# Altium schematic sheet Schematic PoE.schdoc
size 419 x 303 mm
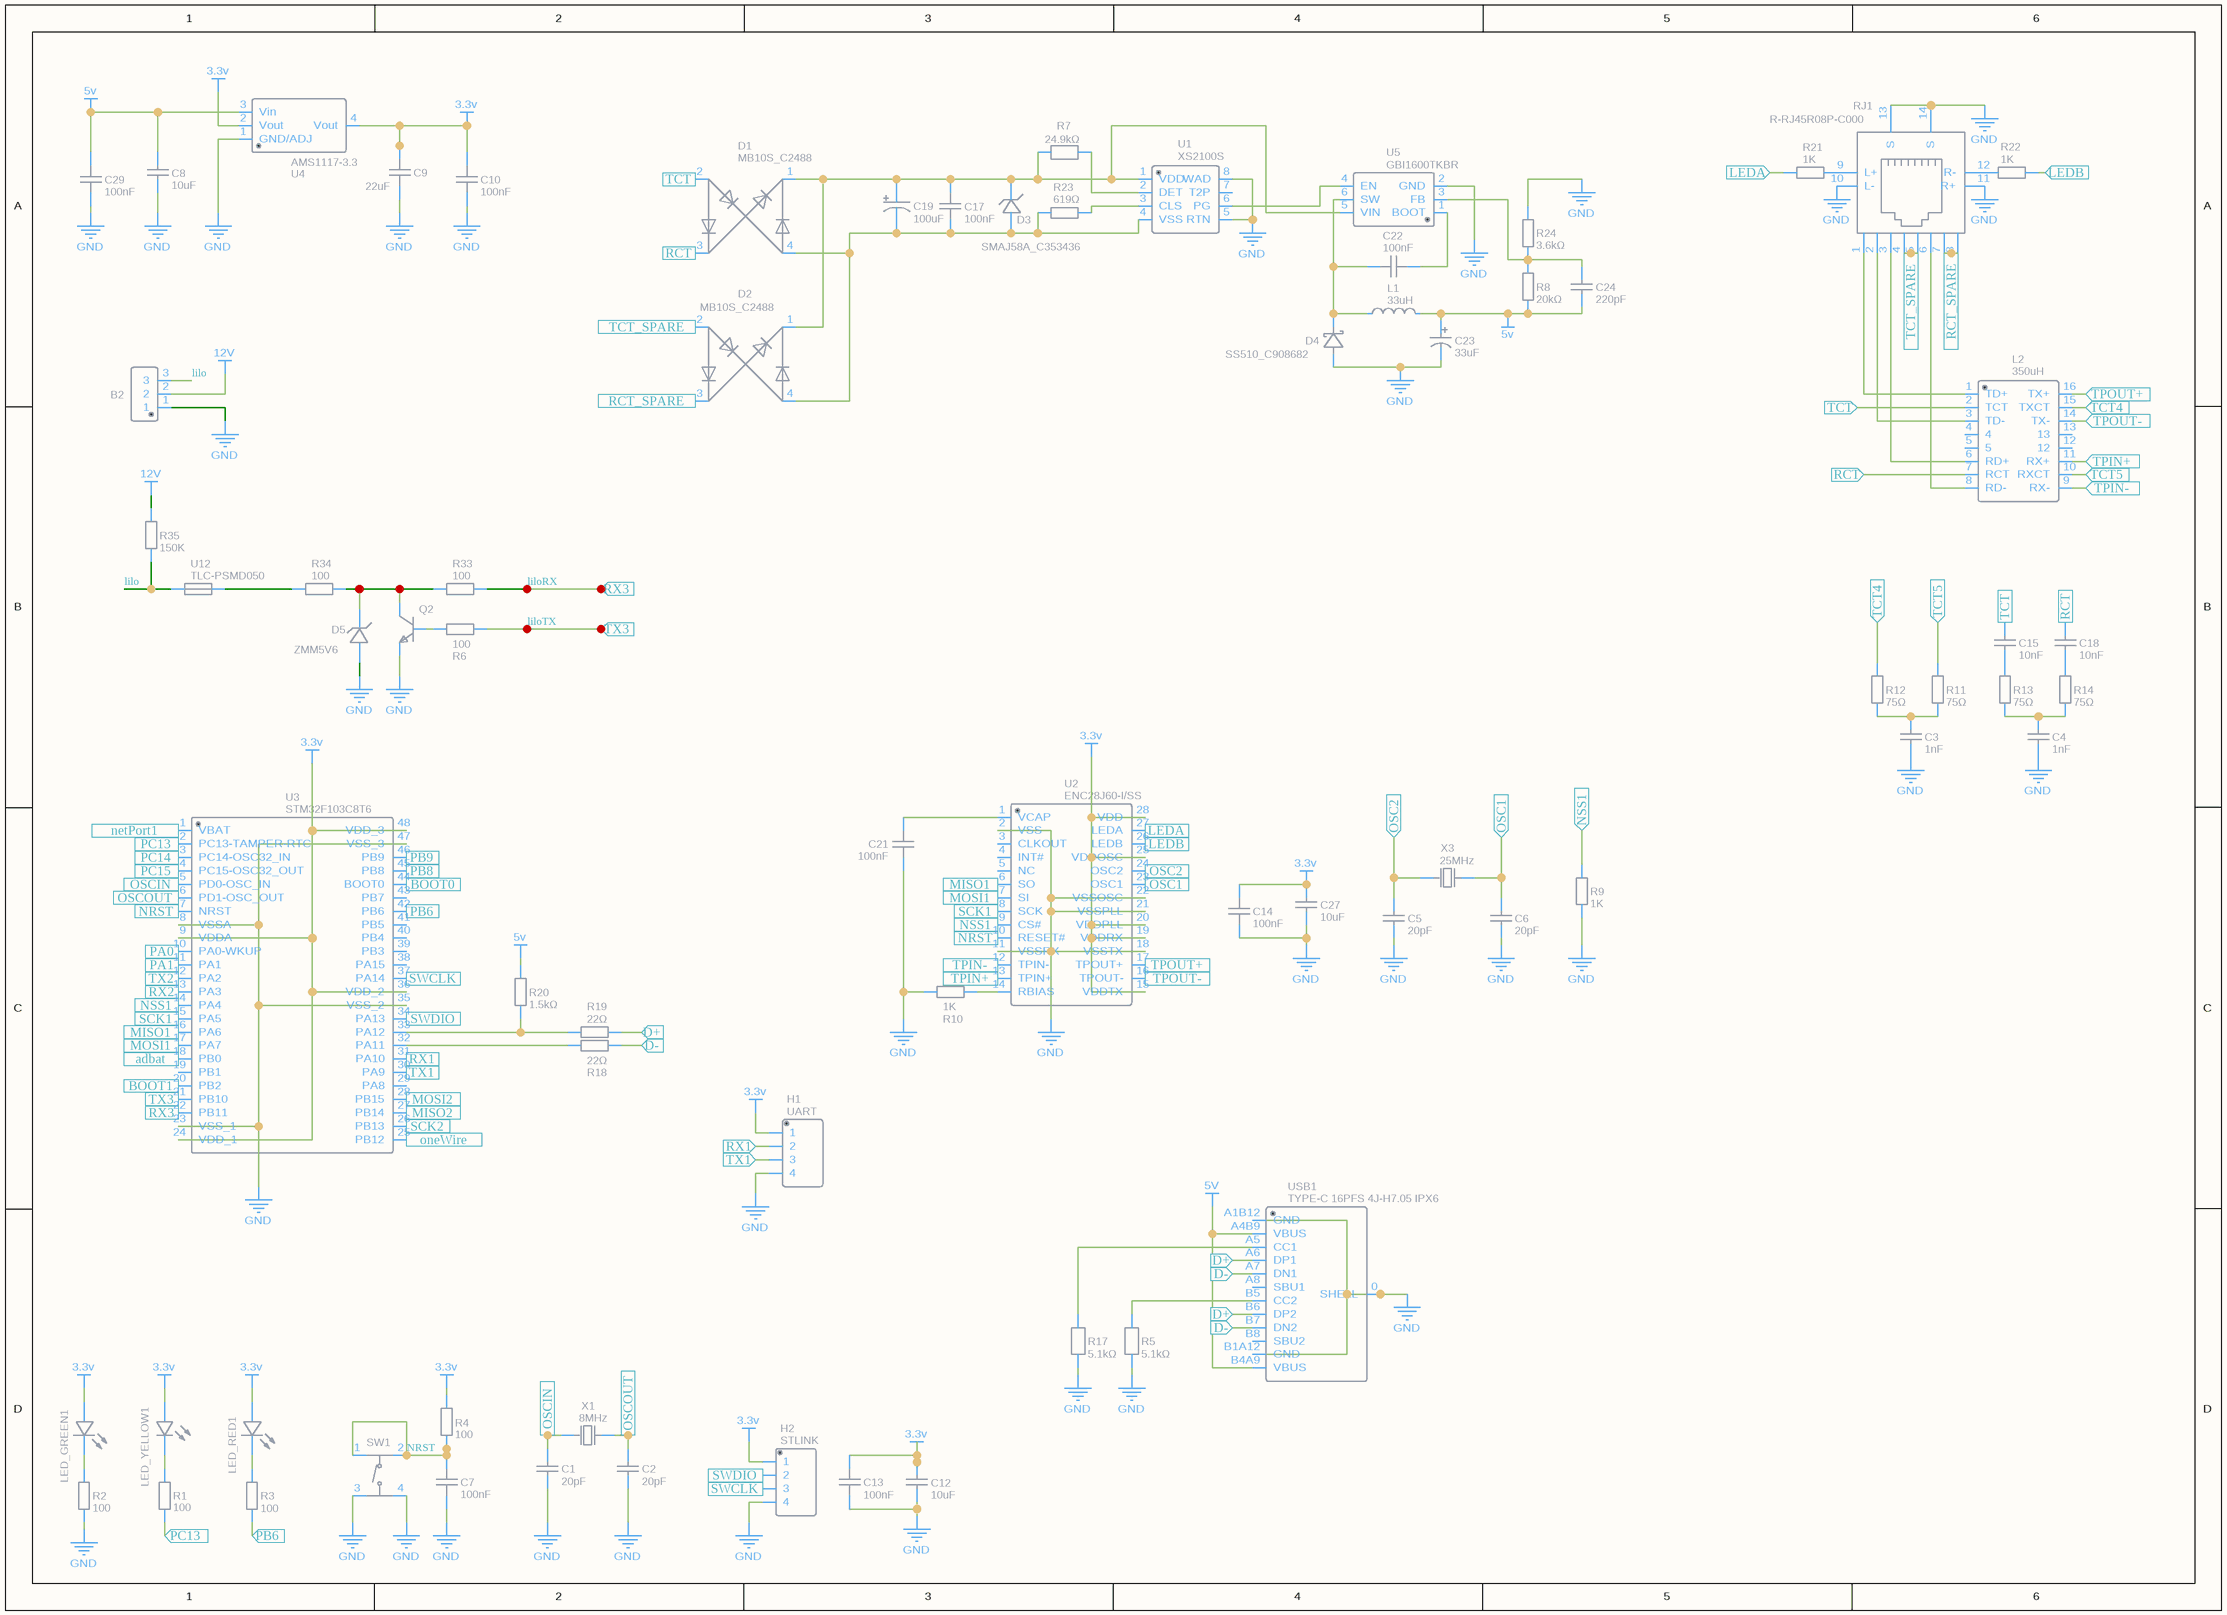
[diagram p0: Schematic PoE.schdoc]

## Parts
B2  XY301V-A-5.0-3P  [CONN-TH_XY301V-A-5.0-3P]  (value not drawn)
C1  20pF  [C0603]
C2  20pF  [C0603]
C3  1nF  [C0402]
C4  1nF  [C0402]
C5  20pF  [C0603]
C6  20pF  [C0603]
C7  100nF  [C0603]
C8  10uF  [C0402]
C9  22uF  [C0603]
C10  100nF  [C0402]
C12  10uF  [C0402]
C13  100nF  [C0402]
C14  100nF  [C0402]
C15  10nF  [C0402]
C17  100nF  [C0402]
C18  10nF  [C0402]
C19  100uF  [CAP-TH_BD6.3-P2.50-D1.0-FD]
C21  100nF  [C0603]
C22  100nF  [C0402]
C23  33uF  [CAP-TH_BD5.0-P2.00-D0.8-FD]
C24  220pF  [C0402]
C27  10uF  [C0402]
C29  100nF  [C0402]
D1  MB10S_C2488  [MBS_L4.7-W3.8-P2.40-LS7.0-TL]
D2  MB10S_C2488  [MBS_L4.7-W3.8-P2.40-LS7.0-TL]
D3  SMAJ58A_C353436  [SMA_L4.3-W2.5-LS5.0-RD]
D4  SS510_C908682  [SMA_L4.3-W2.6-LS5.0-RD]
D5  ZMM5V6  [LL-34_L3.5-W1.5-RD]
H1  UART  [HDR-TH_4P-P2.54-V]
H2  STLINK  [HDR-TH_4P-P2.54-V]
L1  33uH  [IND-SMD_L5.8-W5.2]
L2  350uH  [SMD-16_L12.7-W7.0-P1.27-LS9.5-BL]
LED_GREEN1  KT-0603R  [LED0603-R-RD]  (value not drawn)
LED_RED1  KT-0603R  [LED0603-R-RD]  (value not drawn)
LED_YELLOW1  19-213/Y2C-CQ2R2L/3T(CY)  [LED0603-R-RD]  (value not drawn)
Q2  MMBT3904-C20526  [SOT-23-3_L2.9-W1.3-P1.90-LS2.4-BR]  (value not drawn)
R1  100  [R0603]
R2  100  [R0603]
R3  100  [R0603]
R4  100  [R0603]
R5  5.1kΩ  [R0603]
R6  100  [R0805]
R7  24.9kΩ  [R0603]
R8  20kΩ  [R0402]
R9  1K  [R0603]
R10  1K  [R0603]
R11  75Ω  [R0603]
R12  75Ω  [R0603]
R13  75Ω  [R0603]
R14  75Ω  [R0603]
R17  5.1kΩ  [R0603]
R18  22Ω  [R0603]
R19  22Ω  [R0603]
R20  1.5kΩ  [R0603]
R21  1K  [R0603]
R22  1K  [R0603]
R23  619Ω  [R0603]
R24  3.6kΩ  [R0603]
R33  100  [R0805]
R34  100  [R0805]
R35  150K  [R0805]
RJ1  R-RJ45R08P-C000  [RJ45-TH_R-RJ45R08P-C000]
SW1  TS-1187A-B-A-B  [SW-SMD_4P-L5.1-W5.1-P3.70-LS6.5-TL-2]  (value not drawn)
U1  XS2100S  [SOP-8_L4.9-W3.9-P1.27-LS6.0-BL]
U2  ENC28J60-I/SS  [SSOP-28_L10.2-W5.3-P0.65-LS7.8-BL]
U3  STM32F103C8T6  [LQFP-48_L7.0-W7.0-P0.50-LS9.0-BL]
U4  AMS1117-3.3  [SOT-223-3_L6.5-W3.4-P2.30-LS7.0-BR]
U5  GBI1600TKBR  [TSOT-6_L2.9-W1.6-P0.95-LS2.8-TL]
U12  TLC-PSMD050  [R0805]
USB1  TYPE-C 16PFS 4J-H7.05 IPX6  [TYPE-C-SMD_SOUHAN_6PFS-4J-H7.05-IPX6]
X1  8MHz  [OSC-SMD_L5.0-W3.2]
X3  25MHz  [OSC-SMD_L5.0-W3.2]

## Ports
adbat (in), BOOT0 (in), BOOT1 (in), D+ (in), D- (in), LEDA (in), LEDB (in), MISO1 (in), MISO2 (in), MOSI1 (in), MOSI2 (in), netPort1 (in), NRST (in), NSS1 (in), oneWire (in), OSC1 (in), OSC2 (in), OSCIN (in), OSCOUT (in), PA0 (in), PA1 (in), PB6 (in), PB8 (in), PB9 (in), PC13 (in), PC14 (in), PC15 (in), RCT (in), RCT_SPARE (in), RX1 (in), RX2 (in), RX3 (in), SCK1 (in), SCK2 (in), SWCLK (in), SWDIO (in), TCT4 (in), TCT5 (in), TCT (in), TCT_SPARE (in), TPIN+ (in), TPIN- (in), TPOUT+ (in), TPOUT- (in), TX1 (in), TX2 (in), TX3 (in)

## Nets
3.3v: C9.1 C10.2 C12.2 C13.2 C14.2 C27.2 H1.1 H2.1 LED_GREEN1.1(A) LED_RED1.1(A) LED_YELLOW1.1(A) R4.2 U2.15(VDDTX) U2.19(VDDRX) U2.20(VDDPLL) U2.25(VDDOSC) U2.28(VDD) U3.9(VDDA) U3.24(VDD_1) U3.36(VDD_2) U3.48(VDD_3) U4.2(Vout) U4.4(Vout)
5v: C8.2 C23.1 C24.1 C29.2 L1.2 R8.2 R20.2 U4.3(Vin) USB1.A4B9(VBUS) USB1.B4A9(VBUS)
12V: B2.2 R35.2
GND: B2.1 C1.2 C2.2 C3.1 C4.1 C5.2 C6.2 C7.1 C8.1 C9.2 C10.1 C12.1 C13.1 C14.1 C21.1 C23.2 C27.1 C29.1 D4.2(A) D5.2(A) H1.4 H2.4 Q2.2(E) R2.1 R5.1 R9.1 R10.1 R17.1 R24.1 RJ1.10(L-) RJ1.11(R+) RJ1.13(S) RJ1.14(S) SW1.3(C) SW1.4(D) U1.5(RTN) U1.8(WAD) U2.2(VSS) U2.11(VSSRX) U2.18(VSSTX) U2.21(VSSPLL) U2.22(VSSOSC) U3.8(VSSA) U3.23(VSS_1) U3.35(VSS_2) U3.47(VSS_3) U4.1(GND/ADJ) U5.2(GND) USB1.0(SHELL) USB1.A1B12(GND) USB1.B1A12(GND)
adbat: U3.18(PB0) ; port adbat
BOOT0: U3.44(BOOT0) ; port BOOT0
BOOT1: U3.20(PB2) ; port BOOT1
D+: R19.2 USB1.A6(DP1) USB1.B6(DP2) ; port D+
D-: R18.2 USB1.A7(DN1) USB1.B7(DN2) ; port D-
LEDA: R21.1 U2.27(LEDA) ; port LEDA
LEDB: R22.1 U2.26(LEDB) ; port LEDB
lilo: B2.3 R35.1 U12.1
liloRX: R33.1 U3.22(PB11) ; port RX3
liloTX: R6.1 U3.21(PB10) ; port TX3
MISO1: U2.6(SO) U3.16(PA6) ; port MISO1
MISO2: U3.27(PB14) ; port MISO2
MOSI1: U2.7(SI) U3.17(PA7) ; port MOSI1
MOSI2: U3.28(PB15) ; port MOSI2
netPort1: U3.1(VBAT) ; port netPort1
NRST: U2.10(RESET#) U3.7(NRST) ; port NRST
NRST: C7.2 R4.1 SW1.1(A) SW1.2(B)  [a separate net that carries the same name]
NSS1: R9.2 U2.9(CS#) U3.14(PA4) ; port NSS1
oneWire: U3.25(PB12) ; port oneWire
OSC1: C6.1 U2.23(OSC1) X3.2(OSC2) ; port OSC1
OSC2: C5.1 U2.24(OSC2) X3.1(OSC1) ; port OSC2
OSCIN: C1.1 U3.5(PD0-OSC_IN) X1.1(OSC1) ; port OSCIN
OSCOUT: C2.1 U3.6(PD1-OSC_OUT) X1.2(OSC2) ; port OSCOUT
PA0: U3.10(PA0-WKUP) ; port PA0
PA1: U3.11(PA1) ; port PA1
PB6: R3.1 U3.42(PB6) ; port PB6
PB8: U3.45(PB8) ; port PB8
PB9: U3.46(PB9) ; port PB9
PC13: R1.1 U3.2(PC13-TAMPER-RTC) ; port PC13
PC14: U3.3(PC14-OSC32_IN) ; port PC14
PC15: U3.4(PC15-OSC32_OUT) ; port PC15
RCT: C18.2 D1.3(C2) L2.7(RCT) ; port RCT
RCT_SPARE: D2.3(C2) RJ1.7 RJ1.8 ; port RCT_SPARE
RX1: H1.2 U3.31(PA10) ; port RX1
RX2: U3.13(PA3) ; port RX2
SCK1: U2.8(SCK) U3.15(PA5) ; port SCK1
SCK2: U3.26(PB13) ; port SCK2
SWCLK: H2.3 U3.37(PA14) ; port SWCLK
SWDIO: H2.2 U3.34(PA13) ; port SWDIO
TCT: C15.2 D1.2(-) L2.2(TCT) ; port TCT
TCT4: L2.15(TXCT) R12.2 ; port TCT4
TCT5: L2.10(RXCT) R11.2 ; port TCT5
TCT_SPARE: D2.2(-) RJ1.4 RJ1.5 ; port TCT_SPARE
TPIN+: L2.11(RX+) U2.13(TPIN+) ; port TPIN+
TPIN-: L2.9(RX-) U2.12(TPIN-) ; port TPIN-
TPOUT+: L2.16(TX+) U2.17(TPOUT+) ; port TPOUT+
TPOUT-: L2.14(TX-) U2.16(TPOUT-) ; port TPOUT-
TX1: H1.3 U3.30(PA9) ; port TX1
TX2: U3.12(PA2) ; port TX2
NetC3_2: C3.2 R11.1 R12.1
NetC4_2: C4.2 R13.1 R14.1
NetC15_1: C15.1 R13.2
NetC17_1: C17.1 C19.2 D1.4(C1) D2.4(C1) D3.2(A) R23.1 U1.4(VSS)
NetC17_2: C17.2 C19.1 D1.1(+) D2.1(+) D3.1(C) R7.1 U1.1(VDD) U5.5(VIN)
NetC18_1: C18.1 R14.2
NetC21_2: C21.2 U2.1(VCAP)
NetC22_1: C22.1 U5.1(BOOT)
NetC22_2: C22.2 D4.1(K) L1.1 U5.6(SW)
NetC24_2: C24.2 R8.1 R24.2 U5.3(FB)
NetD5_1: D5.1(C) Q2.3(C) R33.2 R34.2
NetL2_1: L2.1(TD+) RJ1.1
NetL2_3: L2.3(TD-) RJ1.2
NetL2_6: L2.6(RD+) RJ1.3
NetL2_8: L2.8(RD-) RJ1.6
NetLED_GREEN1_2: LED_GREEN1.2(K) R2.2
NetLED_RED1_2: LED_RED1.2(K) R3.2
NetLED_YELLOW1_2: LED_YELLOW1.2(C) R1.2
NetQ2_1: Q2.1(B) R6.2
NetR5_2: R5.2 USB1.B5(CC2)
NetR7_2: R7.2 U1.2(DET)
NetR10_2: R10.2 U2.14(RBIAS)
NetR17_2: R17.2 USB1.A5(CC1)
NetR18_1: R18.1 U3.32(PA11)
NetR19_1: R19.1 R20.1 U3.33(PA12)
NetR21_2: R21.2 RJ1.9(L+)
NetR22_2: R22.2 RJ1.12(R-)
NetR23_2: R23.2 U1.3(CLS)
NetR34_1: R34.1 U12.2
NetU1_6: U1.6(PG) U5.4(EN)

Not connected (* = marked no-connect by the designer): L2 4 5 12 13; U1 7(T2P); U2 3(CLKOUT) 4(INT#) 5(NC); U3 19(PB1) 29(PA8) 38(PA15) 39(PB3) 40(PB4) 41(PB5) 43(PB7); USB1 A8(SBU1) B8(SBU2)

## Library data of the parts
B2 = XY301V-A-5.0-3P: Contributor: LCSC; Supplier: LCSC; Supplier Part: C557652; Manufacturer: --; Manufacturer Part: XY301V-A-5.0-3P; spicePre: U; spiceSymbolName: XY301V-A-5.0-3P
C1 C2 C5 C6 = 20pF: Manufacturer Part: CL10C200JB8NNNC; Manufacturer: SAMSUNG; nameAlias: Capacitance; Supplier: LCSC; Supplier Part: C1648; JLCPCB Part Class: Basic Part; spicePre: C; spiceSymbolName: CL10C200JB8NNNC
C3 C4 = 1nF: Manufacturer: FH(风华); Manufacturer Part: 0402B102K500NT; nameAlias: Value; Supplier: LCSC; Supplier Part: C1523; JLCPCB Part Class: Basic Part; spicePre: C; spiceSymbolName: 0402B102K500NT
C7 C21 = 100nF: Manufacturer: Guangdong Fenghua Advanced Tech; Manufacturer Part: 0603B104K500AT; nameAlias: Capacitance; Contributor: LCSC; Paste Type: Extended Part; Supplier: LCSC; Supplier Part: C191538; JLCPCB Part Class: Extended Part; spicePre: C; spiceSymbolName: 0603B104K500AT
C8 C12 C27 = 10uF: Manufacturer Part: CL05A106MQ5NUNC; Manufacturer: SAMSUNG(三星); nameAlias: Value; Supplier: LCSC; Supplier Part: C15525; JLCPCB Part Class: Basic Part; spicePre: C; spiceSymbolName: CL05A106MQ5NUNC
C9 = 22uF: Manufacturer: SAMSUNG(三星); Manufacturer Part: CL10A226MQ8NRNC; nameAlias: Value; Supplier: LCSC; Supplier Part: C59461; JLCPCB Part Class: Basic Part; spicePre: C; spiceSymbolName: CL10A226MQ8NRNC
C10 C13 C14 C17 C22 C29 = 100nF: Manufacturer Part: CL05B104KO5NNNC; Manufacturer: SAMSUNG(三星); nameAlias: Value; Supplier: LCSC; Supplier Part: C1525; JLCPCB Part Class: Basic Part; spicePre: C; spiceSymbolName: CL05B104KO5NNNC
C15 C18 = 10nF: Manufacturer Part: CL05B103KB5NNNC; Manufacturer: SAMSUNG(三星); nameAlias: Value; Supplier: LCSC; Supplier Part: C15195; JLCPCB Part Class: Basic Part; spicePre: C; spiceSymbolName: CL05B103KB5NNNC
C19 = 100uF: Manufacturer: Ymin(永铭); Manufacturer Part: LKMC2001J101MF; nameAlias: Value; Contributor: LCSC; Supplier: LCSC; Supplier Part: C442931; JLCPCB Part Class: Extended Part; spicePre: C; spiceSymbolName: LKMC2001J101MF
C23 = 33uF: Manufacturer: CX(承兴); Manufacturer Part: KM336M025D11RR0VH2FP0; nameAlias: Value; Supplier: LCSC; Supplier Part: C44585; JLCPCB Part Class: Extended Part; spicePre: C; spiceSymbolName: 33uF 25V 5*11
C24 = 220pF: Manufacturer: FH(风华); Manufacturer Part: 0402B221K500NT; nameAlias: Value; Supplier: LCSC; Supplier Part: C1530; JLCPCB Part Class: Basic Part; spicePre: C; spiceSymbolName: 0402B221K500NT
D1 D2 = MB10S_C2488: Manufacturer: MDD(辰达半导体); Manufacturer Part: MB10S-50MIL; Supplier: LCSC; Supplier Part: C2488; JLCPCB Part Class: Basic Part; spicePre: D; spiceSymbolName: MB10S_C2488
D3 = SMAJ58A_C353436: Manufacturer: 晶导微电子; Contributor: LCSC; Supplier: LCSC; Supplier Part: C353436; Manufacturer Part: SMAJ58A; JLCPCB Part Class: Extended Part; spicePre: D; spiceSymbolName: SMAJ58A_C353436
D4 = SS510_C908682: Manufacturer: GOODWORK(固得沃克); Manufacturer Part: SS510; Contributor: lcsc; Supplier: LCSC; Supplier Part: C908682; JLCPCB Part Class: Extended Part; spicePre: D; spiceSymbolName: SS510_C908682
D5 = ZMM5V6: Manufacturer: SEMTECH; SMT Type: Basic; Supplier: LCSC; Manufacturer Part: ZMM5V6; LCSC Assembly: Yes; image: //image.lceda.cn/szlcsc/C8062.jpg; Supplier Part: C8062; spicePre: D; spiceSymbolName: ZMM5V6
H1 = UART: Manufacturer: Ckmtw; Manufacturer Part: 210S-1*4P L=11.6MMGold-plated black; Contributor: LCSC; Supplier Part: C124378; spicePre: H; spiceSymbolName: Header-Male-2.54_1x4
H2 = STLINK: Manufacturer: Ckmtw; Manufacturer Part: 210S-1*4P L=11.6MMGold-plated black; Contributor: LCSC; Supplier Part: C124378; spicePre: H; spiceSymbolName: Header-Male-2.54_1x4
L1 = 33uH: Manufacturer: SHOU HAN(首韩); Manufacturer Part: CY54-33UH; nameAlias: Value; Contributor: lcsc; Supplier: LCSC; Supplier Part: C2929433; JLCPCB Part Class: Extended Part; spicePre: L; spiceSymbolName: CY54-33UH
L2 = 350uH: Manufacturer: CND-tek(磁联达); Manufacturer Part: B1608S; Contributor: LCSC; nameAlias: Value; Supplier: LCSC; Supplier Part: C507596; JLCPCB Part Class: Extended Part; spicePre: L; spiceSymbolName: B1608S_C507596
LED_GREEN1 LED_RED1 = KT-0603R: Manufacturer: KENTO; Supplier: LCSC; Manufacturer Part: KT-0603R; Supplier Part: C2286; JLCPCB Part Class: Basic Part; spicePre: L; spiceSymbolName: KT-0603R
LED_YELLOW1 = 19-213/Y2C-CQ2R2L/3T(CY): Manufacturer: EVERLIGHT; Supplier: LCSC; Manufacturer Part: 19-213/Y2C-CQ2R2L/3T(CY); Supplier Part: C72038; JLCPCB Part Class: Basic Part; spicePre: L; spiceSymbolName: 19-213/Y2C-CQ2R2L/3T(CY)
Q2 = MMBT3904-C20526: Manufacturer: CJ; SMT Type: Basic; Contributor: 立创EDA官方封装库; Supplier: LCSC; Manufacturer Part: MMBT3904; Supplier Part: C20526; LCSC Assembly: Yes; spicePre: Q; spiceSymbolName: MMBT3904-C20526
R1-R4 = 100: Manufacturer: YAGEO; Manufacturer Part: RC0603FR-07100RL; nameAlias: Resistance (Ohms); Paste Type: Extended Part; Supplier: LCSC; Supplier Part: C105588; JLCPCB Part Class: Extended Part; spicePre: R; spiceSymbolName: RC0603FR-07100RL
R5 R17 = 5.1kΩ: Manufacturer: UNI-ROYAL(厚声); Manufacturer Part: TC0350D5101T5E; Resistance (Ohms): 5.1K; nameAlias: Resistance; Contributor: LCSC; Supplier: LCSC; Supplier Part: C23186; JLCPCB Part Class: Extended Part; spicePre: R; spiceSymbolName: TC0350D5101T5E
R6 R33 R34 = 100: Manufacturer: UniOhm; Manufacturer Part: 0805W8F1000T5E; nameAlias: Resistance (Ohms); SMT Type: Basic; Supplier: LCSC; LCSC Assembly: Yes; Supplier Part: C17408; spicePre: R; spiceSymbolName: 0805W8F1000T5E
R7 = 24.9kΩ: Manufacturer: VO(翔胜); Manufacturer Part: SCR0603F24K9; nameAlias: Value; Contributor: lcsc; Supplier: LCSC; Supplier Part: C3016358; JLCPCB Part Class: Extended Part; spicePre: R; spiceSymbolName: SCR0603F24K9
R8 = 20kΩ: Manufacturer: UNI-ROYAL(厚声); Manufacturer Part: 0402WGF2002TCE; nameAlias: Value; Supplier: LCSC; Supplier Part: C25765; JLCPCB Part Class: Basic Part; spicePre: R; spiceSymbolName: 0402WGF2002TCE
R9 R10 R21 R22 = 1K: Manufacturer: Viking Tech; Manufacturer Part: ARG03FTC1001; nameAlias: Resistance (Ohms); Contributor: LCSC; Supplier: LCSC; Supplier Part: C217840; JLCPCB Part Class: Extended Part; spicePre: R; spiceSymbolName: ARG03FTC1001
R11-R14 = 75Ω: Manufacturer: UNI-ROYAL(厚声); Manufacturer Part: 0603WAF750JT5E; nameAlias: Value; Supplier: LCSC; Supplier Part: C4275; JLCPCB Part Class: Basic Part; spicePre: R; spiceSymbolName: 0603WAF750JT5E
R18 R19 = 22Ω: Manufacturer: UNI-ROYAL(厚声); Manufacturer Part: 0603WAF220JT5E; nameAlias: Resistance; Resistance (Ohms): 22; Supplier: LCSC; Supplier Part: C23345; JLCPCB Part Class: Basic Part; spicePre: R; spiceSymbolName: 0603WAF220JT5E
R20 = 1.5kΩ: Manufacturer: UNI-ROYAL(厚声); Manufacturer Part: 0603WAF1501T5E; nameAlias: Resistance; Resistance (Ohms): 1.5K; Supplier: LCSC; Supplier Part: C22843; JLCPCB Part Class: Basic Part; spicePre: R; spiceSymbolName: 0603WAF1501T5E
R23 = 619Ω: Manufacturer: LIZ(丽智电子); Manufacturer Part: CR0603FA6190G; nameAlias: Value; Contributor: LCSC; Supplier: LCSC; Supplier Part: C101134; JLCPCB Part Class: Extended Part; spicePre: R; spiceSymbolName: CR0603FA6190G
R24 = 3.6kΩ: Manufacturer: UNI-ROYAL(厚声); Manufacturer Part: 0603WAF3601T5E; nameAlias: Value; Supplier: LCSC; Supplier Part: C22980; JLCPCB Part Class: Basic Part; spicePre: R; spiceSymbolName: 0603WAF3601T5E
R35 = 150K: Manufacturer: UniOhm; Manufacturer Part: 0805W8F1503T5E; nameAlias: Resistance (Ohms); SMT Type: Basic; Supplier: LCSC; LCSC Assembly: Yes; Supplier Part: C17470; spicePre: R; spiceSymbolName: 0805W8F1503T5E
RJ1 = R-RJ45R08P-C000: Manufacturer: Ckmtw(灿科盟); Contributor: LCSC; Supplier: LCSC; Supplier Part: C386757; Manufacturer Part: R-RJ45R08P-C000; JLCPCB Part Class: Extended Part; spicePre: R; spiceSymbolName: R-RJ45R08P-C000
SW1 = TS-1187A-B-A-B: Manufacturer: XKB Enterprise; Contributor: LCSC; Supplier: LCSC; Supplier Part: C318884; Manufacturer Part: TS-1187A-B-A-B; JLCPCB Part Class: Extended Part; spicePre: S; spiceSymbolName: TS-1187A-B-A-B
U1 = XS2100S: Manufacturer: chipup(芯昇); Contributor: LCSC; Supplier: LCSC; Supplier Part: C2890398; Manufacturer Part: XS2100S; JLCPCB Part Class: Extended Part; spicePre: U; spiceSymbolName: XS2100S
U2 = ENC28J60-I/SS: Manufacturer: Microchip Tech; Contributor: LCSC; Supplier: LCSC; Supplier Part: C411626; Manufacturer Part: ENC28J60-I/SS; JLCPCB Part Class: Extended Part; spicePre: U; spiceSymbolName: ENC28J60-I/SS
U3 = STM32F103C8T6: Manufacturer: STMicroelectronics; timeStamp: 1455028086; Supplier: LCSC; Manufacturer Part: STM32F103C8T6; Supplier Part: C8734; JLCPCB Part Class: Basic Part; spicePre: U; spiceSymbolName: STM32F103C8T6
U4 = AMS1117-3.3: Manufacturer: AMS; sourceId: dwIGgezVh; timeStamp: 1476261164; Supplier: LCSC; Manufacturer Part: AMS1117-3.3; Supplier Part: C6186; JLCPCB Part Class: Basic Part; spicePre: U; spiceSymbolName: AMS1117-3.3
U5 = GBI1600TKBR: Manufacturer: GOSEMICON(顾邦半导体); Contributor: lcsc; Supplier: LCSC; Supplier Part: C5451750; Manufacturer Part: GBI1600TKBR; JLCPCB Part Class: Extended Part; spicePre: U; spiceSymbolName: GBI1600TKBR
U12 = TLC-PSMD050: Manufacturer: TLC Electronic; Contributor: LCSC; SMT Type: Extend; Supplier: LCSC; Supplier Part: C261942; Manufacturer Part: TLC-PSMD050; LCSC Assembly: Yes; spicePre: U; spiceSymbolName: TLC-PSMD050
USB1 = TYPE-C 16PFS 4J-H7.05 IPX6: Manufacturer: SHOU HAN(首韩); Contributor: lcsc; Supplier: LCSC; Supplier Part: C3020043; Manufacturer Part: TYPE-C 16PFS 4J-H7.05 IPX6; link: https://atta.szlcsc.com/upload/public/pdf/source/20220524/EF320CFE100B0B62934E64AACEA26451.pdf; JLCPCB Part Class: Extended Part; spicePre: U; spiceSymbolName: TYPE-C 16PFS 4J-H7.05 IPX6
X1 = 8MHz: Manufacturer: YXC; Manufacturer Part: X50328MSB2GI; nameAlias: Frequency; Supplier: LCSC; Supplier Part: C115962; JLCPCB Part Class: Basic Part; spicePre: X; spiceSymbolName: X50328MSB2GI
X3 = 25MHz: Manufacturer: YXC; Manufacturer Part: X503225MSB2GI; nameAlias: Frequency; Supplier: LCSC; Supplier Part: C112569; JLCPCB Part Class: Extended Part; spicePre: X; spiceSymbolName: X503225MSB2GI